# EAGLE schematic opaq_n3 (EAGLE 6.3)

## Sheet 1 of 2
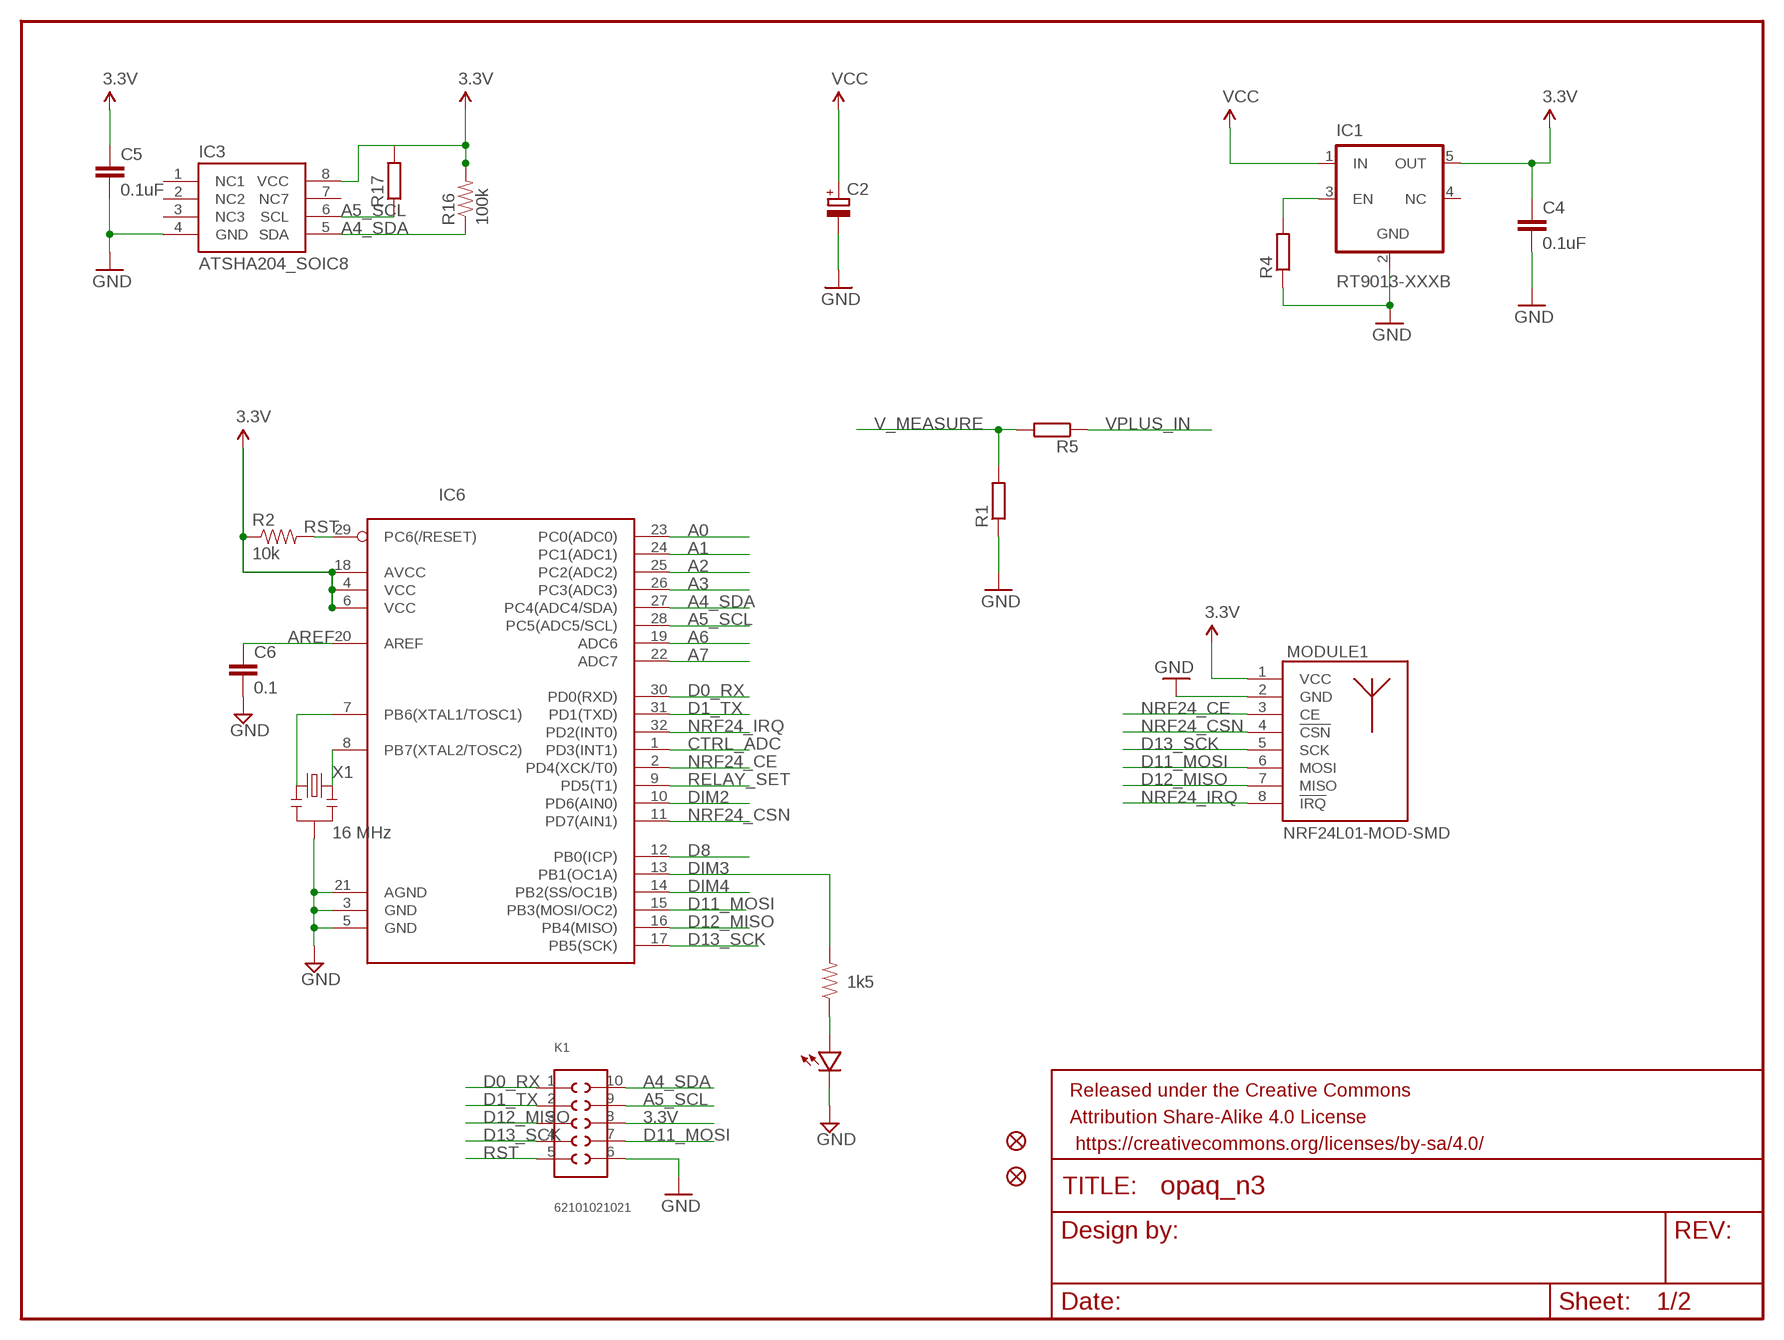
[diagram p0: schematic, sheet 1]

### Parts
C2  CPOL-EUC/6032-28R  [C/6032-28R]
C4  0.1uF  CAP0805  [0805]
C5  0.1uF  CAP0805  [0805]
C6  0.1  CAP0603-CAP  [0603-CAP]
DIM  LED0603  [0603-LED]
FRAME1  FRAME-LETTER  [CREATIVE_COMMONS]
IC1  RT9013-XXXB  [SOT23-5]
IC3  ATSHA204_SOIC8  [SOIC8]
IC6  ATMega-328  ATMEGA168/328MLF  [MLF32]
JP1  FIDUCIAL1X2.5  [FIDUCIAL-1X2.5]
JP2  FIDUCIAL1X2.5  [FIDUCIAL-1X2.5]
K1  62101021021  [62101021021]
MODULE1  NRF24L01-MOD-SMD  [SMD8-MODULE]
R1  R-EU_R0805  [0805]
R2  10k  RESISTOR0603-RES  [0603-RES]
R3  1k5  RESISTOR0603-RES  [0603-RES]
R4  R-EU_R0805  [0805]
R5  R-EU_R0805  [0805]
R16  100k  RESISTOR0805-RES  [0805]
R17  R-EU_R0805  [0805]
X1  16 MHz  RESONATORSMD  [RESONATOR-SMD]

### Nets
3.3V: C4.1 C5.1 IC1.5(OUT) IC3.8(VCC) IC6.4(VCC) IC6.6(VCC) IC6.18(AVCC) K1.8 MODULE1.1(VCC) R2.1 R16.2 R17.2 ; also sheet 2
A0: IC6.23(PC0(ADC0))
A1: IC6.24(PC1(ADC1))
A2: IC6.25(PC2(ADC2))
A3: IC6.26(PC3(ADC3))
A4_SDA: IC3.5(SDA) IC6.27(PC4(ADC4/SDA)) K1.10 R16.1 ; also sheet 2
A5_SCL: IC3.6(SCL) IC6.28(PC5(ADC5/SCL)) K1.9 R17.1 ; also sheet 2
A6: IC6.19(ADC6)
A7: IC6.22(ADC7)
AREF: C6.1 IC6.20(AREF)
CTRL_ADC: IC6.1(PD3(INT1)) ; also sheet 2
D0_RX: IC6.30(PD0(RXD)) K1.1
D1_TX: IC6.31(PD1(TXD)) K1.2
D8: IC6.12(PB0(ICP)) ; also sheet 2
D11_MOSI: IC6.15(PB3(MOSI/OC2)) K1.7 MODULE1.6(MOSI) ; also sheet 2
D12_MISO: IC6.16(PB4(MISO)) K1.3 MODULE1.7(MISO) ; also sheet 2
D13_SCK: IC6.17(PB5(SCK)) K1.4 MODULE1.5(SCK) ; also sheet 2
DIM2: IC6.10(PD6(AIN0))
DIM3: IC6.13(PB1(OC1A)) R3.2
DIM4: IC6.14(PB2(SS/OC1B))
GND: C2.- C4.2 C5.2 C6.2 DIM.MINUS IC1.2(GND) IC3.4(GND) IC6.3(GND) IC6.5(GND) IC6.21(AGND) K1.6 MODULE1.2(GND) R1.1 R4.1 X1.2 ; also sheet 2
N$1: IC6.7(PB6(XTAL1/TOSC1)) X1.1
N$2: DIM.PLUS R3.1
N$10: IC1.3(EN) R4.2
N$21: IC6.8(PB7(XTAL2/TOSC2)) X1.3
NRF24_CE: IC6.2(PD4(XCK/T0)) MODULE1.3(CE)
NRF24_CSN: IC6.11(PD7(AIN1)) MODULE1.4(!CSN)
NRF24_IRQ: IC6.32(PD2(INT0)) MODULE1.8(!IRQ)
RELAY_SET: IC6.9(PD5(T1))
RST: IC6.29(PC6(/RESET)) K1.5 R2.2
V_MEASURE: R1.2 R5.2 ; also sheet 2
VCC: C2.+ IC1.1(IN) ; also sheet 2
VPLUS_IN [power]: R5.1
Unconnected: IC1.4(NC) IC3.1(NC1) IC3.2(NC2) IC3.3(NC3) IC3.7(NC7)

## Sheet 2 of 2
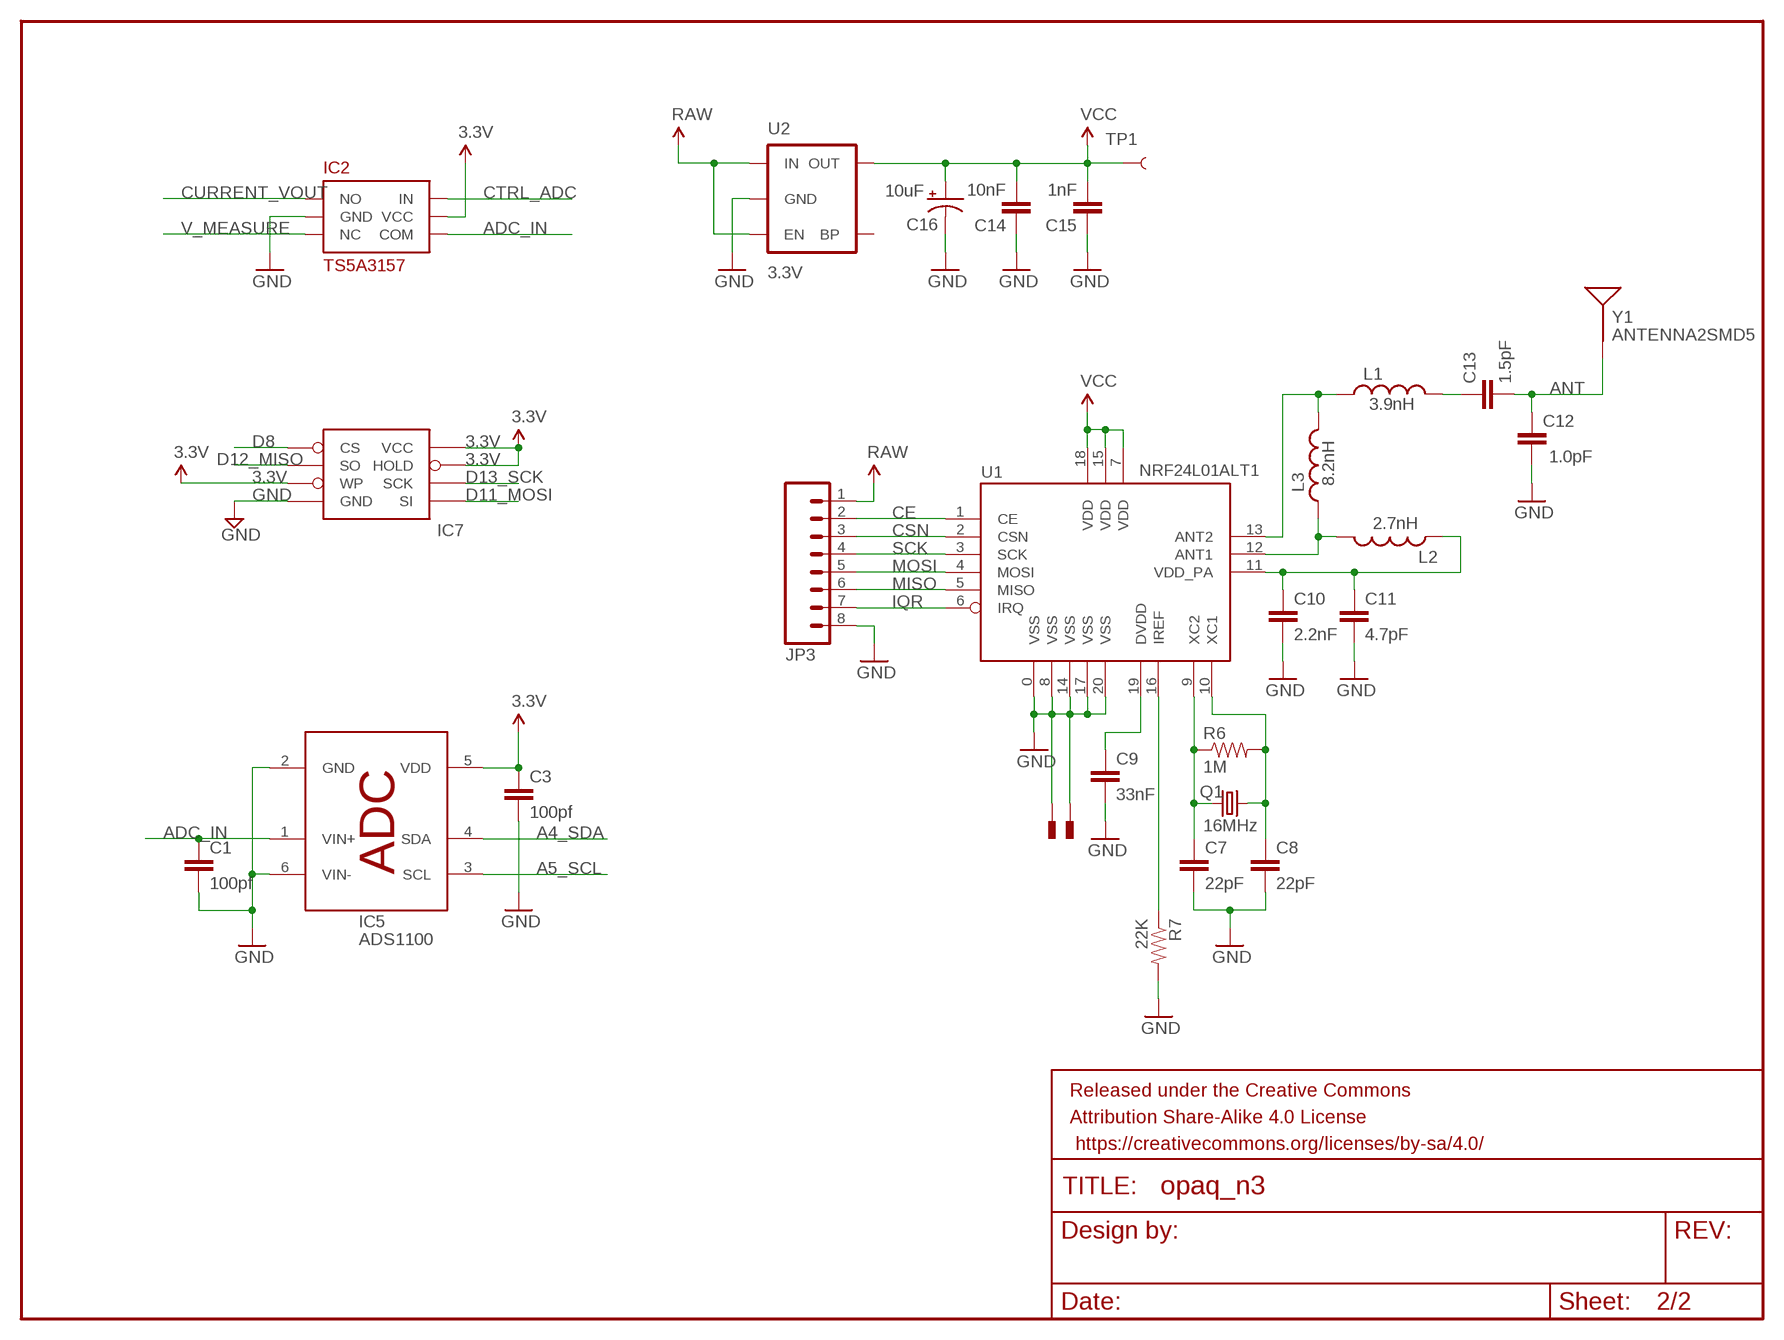
[diagram p1: schematic, sheet 2]

### Parts
C1  100pf  CAP0402-CAP  [0402-CAP]
C3  100pf  CAP0402-CAP  [0402-CAP]
C7  22pF  CAP0402-CAP  [0402-CAP]
C8  22pF  CAP0402-CAP  [0402-CAP]
C9  33nF  CAP0402-CAP  [0402-CAP]
C10  2.2nF  CAP0402-CAP  [0402-CAP]
C11  4.7pF  CAP0402-CAP  [0402-CAP]
C12  1.0pF  CAP0402-CAP  [0402-CAP]
C13  1.5pF  CAP0402-CAP  [0402-CAP]
C14  10nF  CAP0402-CAP  [0402-CAP]
C15  1nF  CAP0402-CAP  [0402-CAP]
C16  10uF  CAP_POL1206  [EIA3216]
FRAME2  FRAME-LETTERNO_PACKAGE  [DUMMY]
IC2  TS5A3157  [SOT23-6]
IC5  ADS1100  [SOT23-6]
IC7  AT25F512BWIDE_5.3MM  [SO08WIDE]
JP3  M081X08  [1X08]
L1  3.9nH  INDUCTOR0402  [C0402]
L2  2.7nH  INDUCTOR0402  [C0402]
L3  8.2nH  INDUCTOR0402  [C0402]
Q1  16MHz  CRYSTAL5X3  [CRYSTAL-SMD-5X3]
R6  1M  RESISTOR0402-RES  [0402-RES]
R7  22K  RESISTOR0402-RES  [0402-RES]
TP1  TEST-POINT3X5  [PAD.03X.05]
U1  NRF24L01ALT1  [QFN20_ALT1]
U2  3.3V  V_REG_LDOSMD  [SOT23-5]
U$1  PAD  [PAD-0.008]
U$4  PAD  [PAD-0.008]
Y1  ANTENNA2SMD5  [ANTENNA-CHIP5]

### Nets
3.3V: C3.1 IC2.5(VCC) IC5.5(VDD) IC7.3(WP) IC7.7(HOLD) IC7.8(VCC) ; also sheet 1
A4_SDA: IC5.4(SDA) ; also sheet 1
A5_SCL: IC5.3(SCL) ; also sheet 1
ADC_IN: C1.1 IC2.4(COM) IC5.1(VIN+)
ANT: C12.2 C13.2 Y1.FEED(SIGNAL)
CE: JP3.2 U1.1(CE)
CSN: JP3.3 U1.2(CSN)
CTRL_ADC: IC2.6(IN) ; also sheet 1
CURRENT_VOUT: IC2.1(NO)
D8: IC7.1(CS) ; also sheet 1
D11_MOSI: IC7.5(SI) ; also sheet 1
D12_MISO: IC7.2(SO) ; also sheet 1
D13_SCK: IC7.6(SCK) ; also sheet 1
GND: C1.2 C3.2 C7.2 C8.2 C9.2 C10.2 C11.2 C12.1 C14.1 C15.1 C16.C(-) IC2.2(GND) IC5.2(GND) IC5.6(VIN-) IC7.4(GND) JP3.8 R7.2 U1.0(VSS) U1.8(VSS) U1.14(VSS) U1.17(VSS) U1.20(VSS) U2.2(GND) U$1.P$1 U$4.P$1 ; also sheet 1
IQR: JP3.7 U1.6(IRQ)
MISO: JP3.6 U1.5(MISO)
MOSI: JP3.5 U1.4(MOSI)
N$3: C7.1 Q1.1 R6.1 U1.9(XC2)
N$4: C8.1 Q1.3 R6.2 U1.10(XC1)
N$5: R7.1 U1.16(IREF)
N$6: L1.1 L3.2 U1.13(ANT2)
N$7: C10.1 C11.1 L2.1 U1.11(VDD_PA)
N$8: C9.1 U1.19(DVDD)
N$9: L2.2 L3.1 U1.12(ANT1)
N$11: C13.1 L1.2
RAW: JP3.1 U2.1(IN) U2.3(EN)
SCK: JP3.4 U1.3(SCK)
V_MEASURE: IC2.3(NC) ; also sheet 1
VCC: C14.2 C15.2 C16.A(+) TP1.P$1 U1.7(VDD) U1.15(VDD) U1.18(VDD) U2.5(OUT) ; also sheet 1
Unconnected: U2.4(BP)

## Library data of the parts
C1 C3-C5 = SparkFun-Passives:CAP: Capacitor Standard 0603 ceramic capacitor, and 0.1" leaded capacitor.
C2 = rcl:CPOL-EU: POLARIZED CAPACITOR, European symbol
C6 = LowPowerLab:CAP: Capacitor Standard 0603 ceramic capacitor, and 0.1" leaded capacitor.
C7-C15 = SparkFun:CAP: Capacitor Standard 0603 ceramic capacitor, and 0.1" leaded capacitor.
C16 = SparkFun:CAP_POL: Capacitor Polarized These are standard SMD and PTH capacitors. Normally 10uF, 47uF, and 100uF in electrolytic and tantalum varieties. Always verify the external diameter of the through hole cap, it varies with capacity, voltage, and manufacturer. The EIA devices should be standard.
DIM = LowPowerLab:LED
FRAME1 = SparkFun-Aesthetics:FRAME-LETTER: Schematic Frame Standard 8.5x11 US Letter frame
FRAME2 = SparkFun-Aesthetics:FRAME-LETTER: Schematic Frame Standard 8.5x11 US Letter frame; DESIGNER: Nobody; VERSION: v01
IC1 = v-reg_extra:RT9013-XXX: LDO REGULATOR 500mA, Low Dropout, Low Noise Ultra-Fast without bypass capacitor CMOS LDO Regulator
IC2 = pimoroni:TS5A3157: TS5A3157: 10-Ω SPDT ANALOG SWITCH The TS5A3157 is a single-pole double-throw (SPDT) analog switch that is designed to operate from 1.65V to 5.5V. This device can handle both digital and analog signals, and signals up to V+ can be transmitted in either direction.
IC3 = SparkFun-DigitalIC:ATSHA204_SOIC8: ATSHA204; PROD_ID: IC-11981
IC5 = bytewerk-analog:ADS1100: 16-Bit ANALOG-TO-DIGITAL CONVERTER, I2C; MF: TI; MPN: ADS1100; OC_MOUSER: 595-ADS1100A1IDBVT
IC6 = LowPowerLab:ATMEGA168/328: Atmel 32-pin 8-bit micro, 16k flash.
IC7 = LowPowerLab:AT25F512B: 4-Mbit SPI flash memory
JP1 JP2 = SparkFun:FIDUCIAL: Fiducial Alignment Points Various fiducial points for machine vision alignment.
JP3 = SparkFun:M08: Header 8 Standard 8-pin 0.1" header. Use with straight break away headers (SKU : PRT-00116), right angle break away headers (PRT-00553), swiss pins (PRT-00743), machine pins (PRT-00117), and female headers (PRT-00115).
K1 = Wurth_Elektronik_Electromechanic_Board_to_Board_Connectors_rev15c:62101021021: WR-PHD 1.27mm Dual SMT Pin Header H=3.80 mm, 10 Pins=>Code : Con_BTB_PHD_1.27_2_62101021021 <http://katalog.we-online.de/media/thumbs2/eican/thb_Con_BTB_PHD_1.27_2_6210xx21021_pf2.jpg> Details see: http://katalog.we-online.de/en/em/621_0xx_210_21 Created 2014-06-03, Karrer Zheng 2014 (C) Würth Elektronik
L1-L3 = SparkFun:INDUCTOR: Inductors Basic Inductor/Choke - 0603 and 1206. Footprints are not proven and vary greatly between part numbers.
MODULE1 = nrf24l01:NRF24L01-MOD: NRF24L01 based module VCC = 1.9~3.6V
Q1 = SparkFun:CRYSTAL: Crystals Various standard crystals. Proven footprints. Spark Fun Electronics SKU : COM-00534
R1 R4 R5 R17 = resistor:R-EU_: RESISTOR, European symbol
R2 R3 = LowPowerLab:RESISTOR: Resistor Basic schematic elements and footprints for 0603, 1206, and PTH resistors.
R6 R7 = SparkFun:RESISTOR: Resistor Basic schematic elements and footprints for 0603, 1206, and PTH resistors.
R16 = SparkFun-Passives:RESISTOR: Resistor Basic schematic elements and footprints for 0603, 1206, and PTH resistors.
TP1 = SparkFun:TEST-POINT
U1 = Testing:NRF24L01: 2.4GHz Low Power Transceiver This is the very popular, low cost, very low power RF transceiver from Nordic Semiconductor. Simple SPI interface. SKU: COM-00690
U2 = SparkFun:V_REG_LDO: Voltage Regulator LDO Standard 150mA LDO voltage regulator in SOT-23 layout. Micrel part MIC5205. BP (by-pass) pin is used to lower output noise with 470pF cap.
U$1 U$4 = Testing:PAD
X1 = SparkFun:RESONATOR: Resonator Small SMD resonator. This is the itty bitty 10/20MHz resonators with built in caps. CSTCE10M0G55 and CSTCE20M0V53. Footprint has been reviewed closely but hasn't been tested yet.
Y1 = SparkFun:ANTENNA2: Antenna Single endded antenna. Common with smaller chip antennas. CHIP4 package is the GPS Chip Antenna SKU: GPS-08418. CHIP5 package is 2.4GHz chip antenna SKU: WRL-00144.

## Net classes
1 power: width 0.381 mm, clearance 0.254 mm
2 gnd: width 0.305 mm, drill 0.406 mm, clearance 0.203 mm
3 power usb: width 0.508 mm, drill 0.406 mm, clearance 0.203 mm